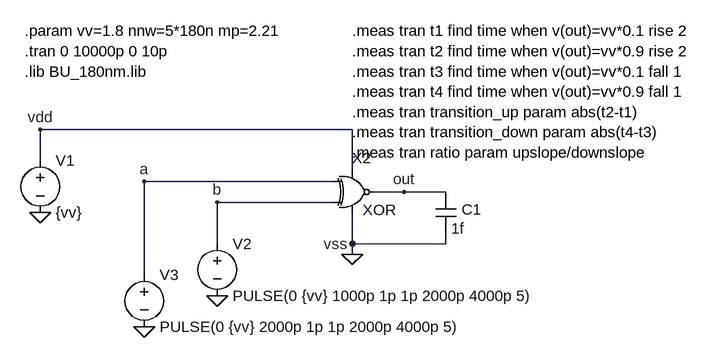
[diagram p0: schematic xor_test.asc]
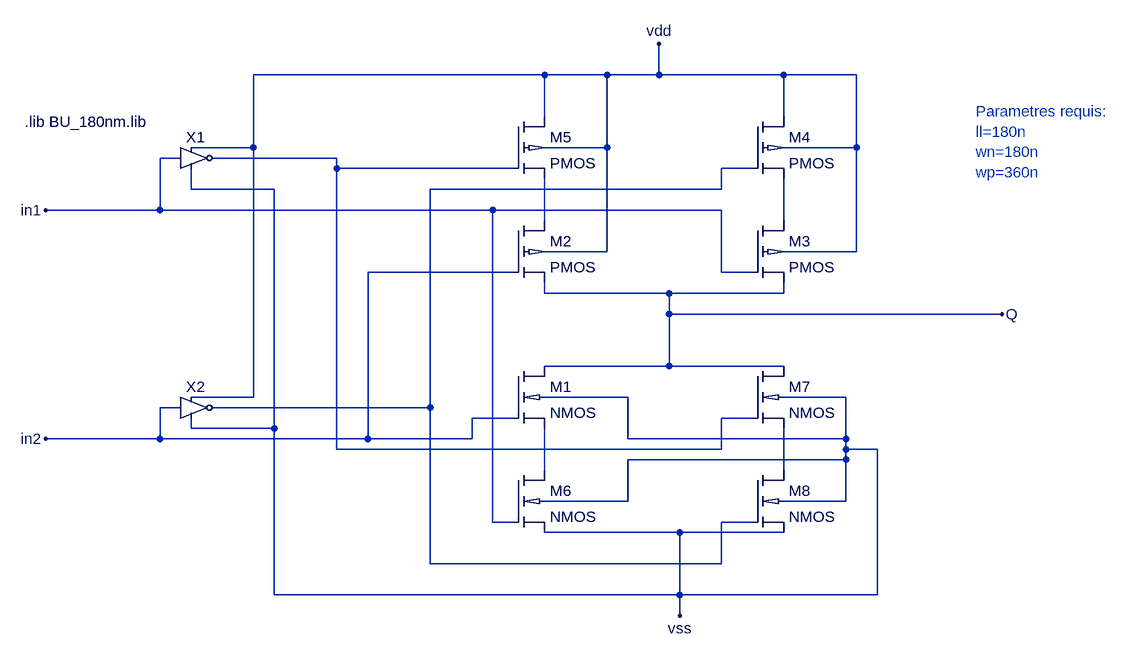
[diagram p1: sub-circuit xor.asc]
xor_test.asc, the LTspice schematic file:
Version 4
SHEET 1 1168 680
WIRE 416 224 -64 224
WIRE -64 272 -64 224
WIRE 416 288 416 224
WIRE 384 304 96 304
WIRE 496 320 448 320
WIRE 560 320 496 320
WIRE 384 336 208 336
WIRE 208 400 208 336
WIRE 416 400 416 352
WIRE 560 400 560 384
WIRE 560 400 416 400
WIRE 416 416 416 400
WIRE 96 448 96 304
FLAG -64 352 0
FLAG 208 480 0
FLAG 416 416 0
FLAG -64 224 vdd
FLAG 416 400 vss
FLAG 208 336 b
FLAG 496 320 out
FLAG 96 528 0
FLAG 96 304 a
SYMBOL /voltage -64 256 R0
SYMATTR InstName V1
SYMATTR Value {vv}
SYMBOL /voltage 208 384 R0
SYMATTR InstName V2
SYMATTR Value PULSE(0 {vv} 1000p 1p 1p 2000p 4000p 5)
SYMBOL xor 416 320 R0
SYMATTR InstName X2
SYMATTR SpiceLine ll=180n wn={nnw} wp={nnw*mp}
SYMBOL /voltage 96 432 R0
SYMATTR InstName V3
SYMATTR Value PULSE(0 {vv} 2000p 1p 1p 2000p 4000p 5)
SYMBOL cap 544 320 R0
WINDOW 0 40 27 Left 2
SYMATTR InstName C1
SYMATTR Value 1f
TEXT -88 72 Left 2 !.param vv=1.8 nnw=5*180n mp=2.21\n.tran 0 10000p 0 10p\n.lib BU_180nm.lib
TEXT 416 72 Left 2 !.meas tran t1 find time when v(out)=vv*0.1 rise 2\n.meas tran t2 find time when v(out)=vv*0.9 rise 2\n.meas tran t3 find time when v(out)=vv*0.1 fall 1\n.meas tran t4 find time when v(out)=vv*0.9 fall 1\n.meas tran transition_up param abs(t2-t1)\n.meas tran transition_down param abs(t4-t3)\n.meas tran ratio param upslope/downslope

xor.asc, the sub-circuit schematic file:
Version 4
SHEET 1 1192 916
WIRE 144 0 -304 0
WIRE 240 0 144 0
WIRE 320 0 320 -48
WIRE 320 0 240 0
WIRE 512 0 320 0
WIRE 624 0 512 0
WIRE 144 64 144 0
WIRE 512 64 512 0
WIRE -304 112 -304 0
WIRE -304 112 -400 112
WIRE 240 112 240 0
WIRE 240 112 144 112
WIRE 624 112 624 0
WIRE 624 112 512 112
WIRE -416 128 -448 128
WIRE -176 128 -368 128
WIRE -176 144 -176 128
WIRE 96 144 -176 144
WIRE 464 144 416 144
WIRE -400 176 -400 144
WIRE -272 176 -400 176
WIRE 416 176 416 144
WIRE 416 176 -32 176
WIRE -448 208 -448 128
WIRE -448 208 -624 208
WIRE 64 208 -448 208
WIRE 416 208 64 208
WIRE 144 224 144 160
WIRE 512 224 512 160
WIRE 240 272 240 112
WIRE 240 272 144 272
WIRE 624 272 624 112
WIRE 624 272 512 272
WIRE 96 304 -128 304
WIRE 416 304 416 208
WIRE 464 304 416 304
WIRE 144 336 144 320
WIRE 336 336 144 336
WIRE 512 336 512 320
WIRE 512 336 336 336
WIRE 336 368 336 336
WIRE 848 368 336 368
WIRE 336 448 336 368
WIRE 336 448 144 448
WIRE 512 448 336 448
WIRE -304 496 -304 112
WIRE -304 496 -400 496
WIRE 272 496 144 496
WIRE 608 496 512 496
WIRE -416 512 -448 512
WIRE -32 512 -32 176
WIRE -32 512 -368 512
WIRE 96 528 32 528
WIRE 464 528 416 528
WIRE -400 544 -400 528
WIRE -272 544 -272 176
WIRE -272 544 -400 544
WIRE -448 560 -448 512
WIRE -448 560 -624 560
WIRE -128 560 -128 304
WIRE -128 560 -448 560
WIRE 32 560 32 528
WIRE 32 560 -128 560
WIRE 272 560 272 496
WIRE 608 560 608 496
WIRE 608 560 272 560
WIRE -176 576 -176 144
WIRE 416 576 416 528
WIRE 416 576 -176 576
WIRE 608 576 608 560
WIRE 656 576 608 576
WIRE 608 592 608 576
WIRE 608 592 272 592
WIRE 144 608 144 544
WIRE 512 608 512 544
WIRE 272 656 272 592
WIRE 272 656 144 656
WIRE 608 656 608 592
WIRE 608 656 512 656
WIRE 64 688 64 208
WIRE 96 688 64 688
WIRE 464 688 416 688
WIRE 352 704 144 704
WIRE 512 704 352 704
WIRE -32 752 -32 512
WIRE 416 752 416 688
WIRE 416 752 -32 752
WIRE -272 800 -272 544
WIRE 352 800 352 704
WIRE 352 800 -272 800
WIRE 656 800 656 576
WIRE 656 800 352 800
WIRE 352 832 352 800
FLAG -624 208 in1
FLAG -624 560 in2
FLAG 352 832 vss
FLAG 320 -48 vdd
FLAG 848 368 Q
SYMBOL pmos018 464 224 R0
SYMATTR InstName M3
SYMATTR Value2 l={ll} w={wp} ad={450n*{wp}} as={450n*{wp}} pd={900n+{wp}} ps={1080n+{wp}}
SYMBOL pmos018 464 64 R0
SYMATTR InstName M4
SYMATTR Value2 l={ll} w={wp} ad={450n*{wp}} as={450n*{wp}} pd={900n+{wp}} ps={1080n+{wp}}
SYMBOL pmos018 96 64 R0
SYMATTR InstName M5
SYMATTR Value2 l={ll} w={wp} ad={450n*{wp}} as={450n*{wp}} pd={900n+{wp}} ps={1080n+{wp}}
SYMBOL nmos018 96 608 R0
SYMATTR InstName M6
SYMATTR Value2 l={ll} w={wn} ad={450n*{wn}} as={450n*{wn}} pd={900n+{wn}} ps={1080n+{wn}}
SYMBOL nmos018 464 448 R0
SYMATTR InstName M7
SYMATTR Value2 l={ll} w={wn} ad={450n*{wn}} as={450n*{wn}} pd={900n+{wn}} ps={1080n+{wn}}
SYMBOL nmos018 464 608 R0
SYMATTR InstName M8
SYMATTR Value2 l={ll} w={wn} ad={450n*{wn}} as={450n*{wn}} pd={900n+{wn}} ps={1080n+{wn}}
SYMBOL inv -400 128 R0
SYMATTR InstName X1
SYMATTR SpiceLine ll=180n wn={nnw} wp={nnw*mp}
SYMBOL inv -400 512 R0
SYMATTR InstName X2
SYMATTR SpiceLine ll=180n wn={nnw} wp={nnw*mp}
SYMBOL nmos018 96 448 R0
SYMATTR InstName M1
SYMATTR Value2 l={ll} w={wn} ad={450n*{wn}} as={450n*{wn}} pd={900n+{wn}} ps={1080n+{wn}}
SYMBOL pmos018 96 224 R0
SYMATTR InstName M2
SYMATTR Value2 l={ll} w={wp} ad={450n*{wp}} as={450n*{wp}} pd={900n+{wp}} ps={1080n+{wp}}
TEXT -656 72 Left 2 !.lib BU_180nm.lib
TEXT 808 56 Left 2 ;Parametres requis: \nll=180n\nwn=180n  \nwp=360n

The netlist it stands for:
* xor_test.asc
V1 vdd 0 {vv}
V2 b 0 PULSE(0 {vv} 1000p 1p 1p 2000p 4000p 5)
XX2 a out vdd 0 b xor params: XOR ll=180n wn={nnw} wp={nnw*mp}
V3 a 0 PULSE(0 {vv} 2000p 1p 1p 2000p 4000p 5)
C1 out 0 1f

* block symbol definitions
.subckt xor in1 Q vdd vss in2
M3 N004 in1 Q vdd PMOS l={ll} w={wp} ad={450n*{wp}} as={450n*{wp}} pd={900n+{wp}} ps={1080n+{wp}}
M4 vdd N002 N004 vdd PMOS l={ll} w={wp} ad={450n*{wp}} as={450n*{wp}} pd={900n+{wp}} ps={1080n+{wp}}
M5 vdd N001 N003 vdd PMOS l={ll} w={wp} ad={450n*{wp}} as={450n*{wp}} pd={900n+{wp}} ps={1080n+{wp}}
M6 N005 in1 vss vss NMOS l={ll} w={wn} ad={450n*{wn}} as={450n*{wn}} pd={900n+{wn}} ps={1080n+{wn}}
M7 Q N001 N006 vss NMOS l={ll} w={wn} ad={450n*{wn}} as={450n*{wn}} pd={900n+{wn}} ps={1080n+{wn}}
M8 N006 N002 vss vss NMOS l={ll} w={wn} ad={450n*{wn}} as={450n*{wn}} pd={900n+{wn}} ps={1080n+{wn}}
XX1 in1 N001 vdd vss inv ll=180n wn={nnw} wp={nnw*mp}  ; pins In _Q vdd vss
XX2 in2 N002 vdd vss inv ll=180n wn={nnw} wp={nnw*mp}  ; pins In _Q vdd vss
M1 Q in2 N005 vss NMOS l={ll} w={wn} ad={450n*{wn}} as={450n*{wn}} pd={900n+{wn}} ps={1080n+{wn}}
M2 N003 in2 Q vdd PMOS l={ll} w={wp} ad={450n*{wp}} as={450n*{wp}} pd={900n+{wp}} ps={1080n+{wp}}
.lib BU_180nm.lib
* Parametres requis:
* ll=180n
* wn=180n
* wp=360n
.ends xor

.model NMOS NMOS
.model PMOS PMOS
.lib standard.mos
.param vv=1.8 nnw=5*180n mp=2.21
.tran 0 10000p 0 10p
.lib BU_180nm.lib
.meas tran t1 find time when v(out)=vv*0.1 rise 2
.meas tran t2 find time when v(out)=vv*0.9 rise 2
.meas tran t3 find time when v(out)=vv*0.1 fall 1
.meas tran t4 find time when v(out)=vv*0.9 fall 1
.meas tran transition_up param abs(t2-t1)
.meas tran transition_down param abs(t4-t3)
.meas tran ratio param upslope/downslope
.lib BU_180nm.lib
.backanno
.end

* Results of the author's LTspice run, read from the files saved beside the schematic
* Operating Point, zero values left out:
*   V(vdd) = 1.8 V
*   V(out) = 4.435 µV
*   I(V1) = -4.631 nA
*   Ix(x2:VDD) = 4.631 nA
*   Ix(x2:VSS) = -4.631 nA
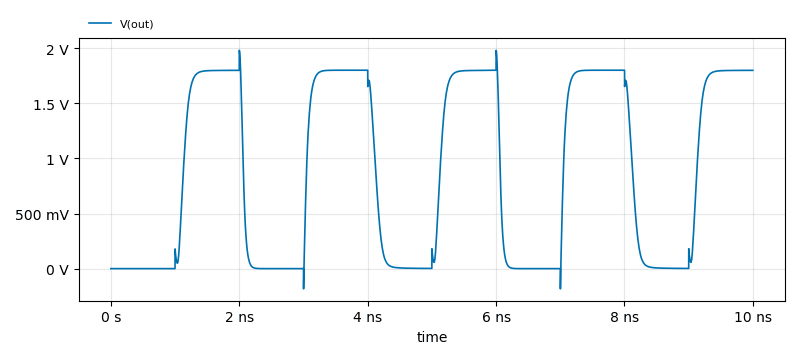
[diagram p2: Transient Analysis of xor_test.asc, plotted from the saved traces]
* Transient Analysis, 1 run:
*   V(out): min -183.1 mV, max 1.98 V, average 875.2 mV, rms 1.216 V, last 1.799 V
* From the log:
*   t1: time=3.01493e-009 at 3.01493e-009
*   t2: time=3.13203e-009 at 3.13203e-009
*   t3: time=2.12204e-009 at 2.12204e-009
*   t4: time=2.03015e-009 at 2.03015e-009
*   transition_up: abs(t2-t1)=1.17105e-010
*   transition_down: abs(t4-t3)=9.18879e-011
*   Measurement "ratio" FAIL'ed